# EAGLE design supply1 (EAGLE 7.5.0)
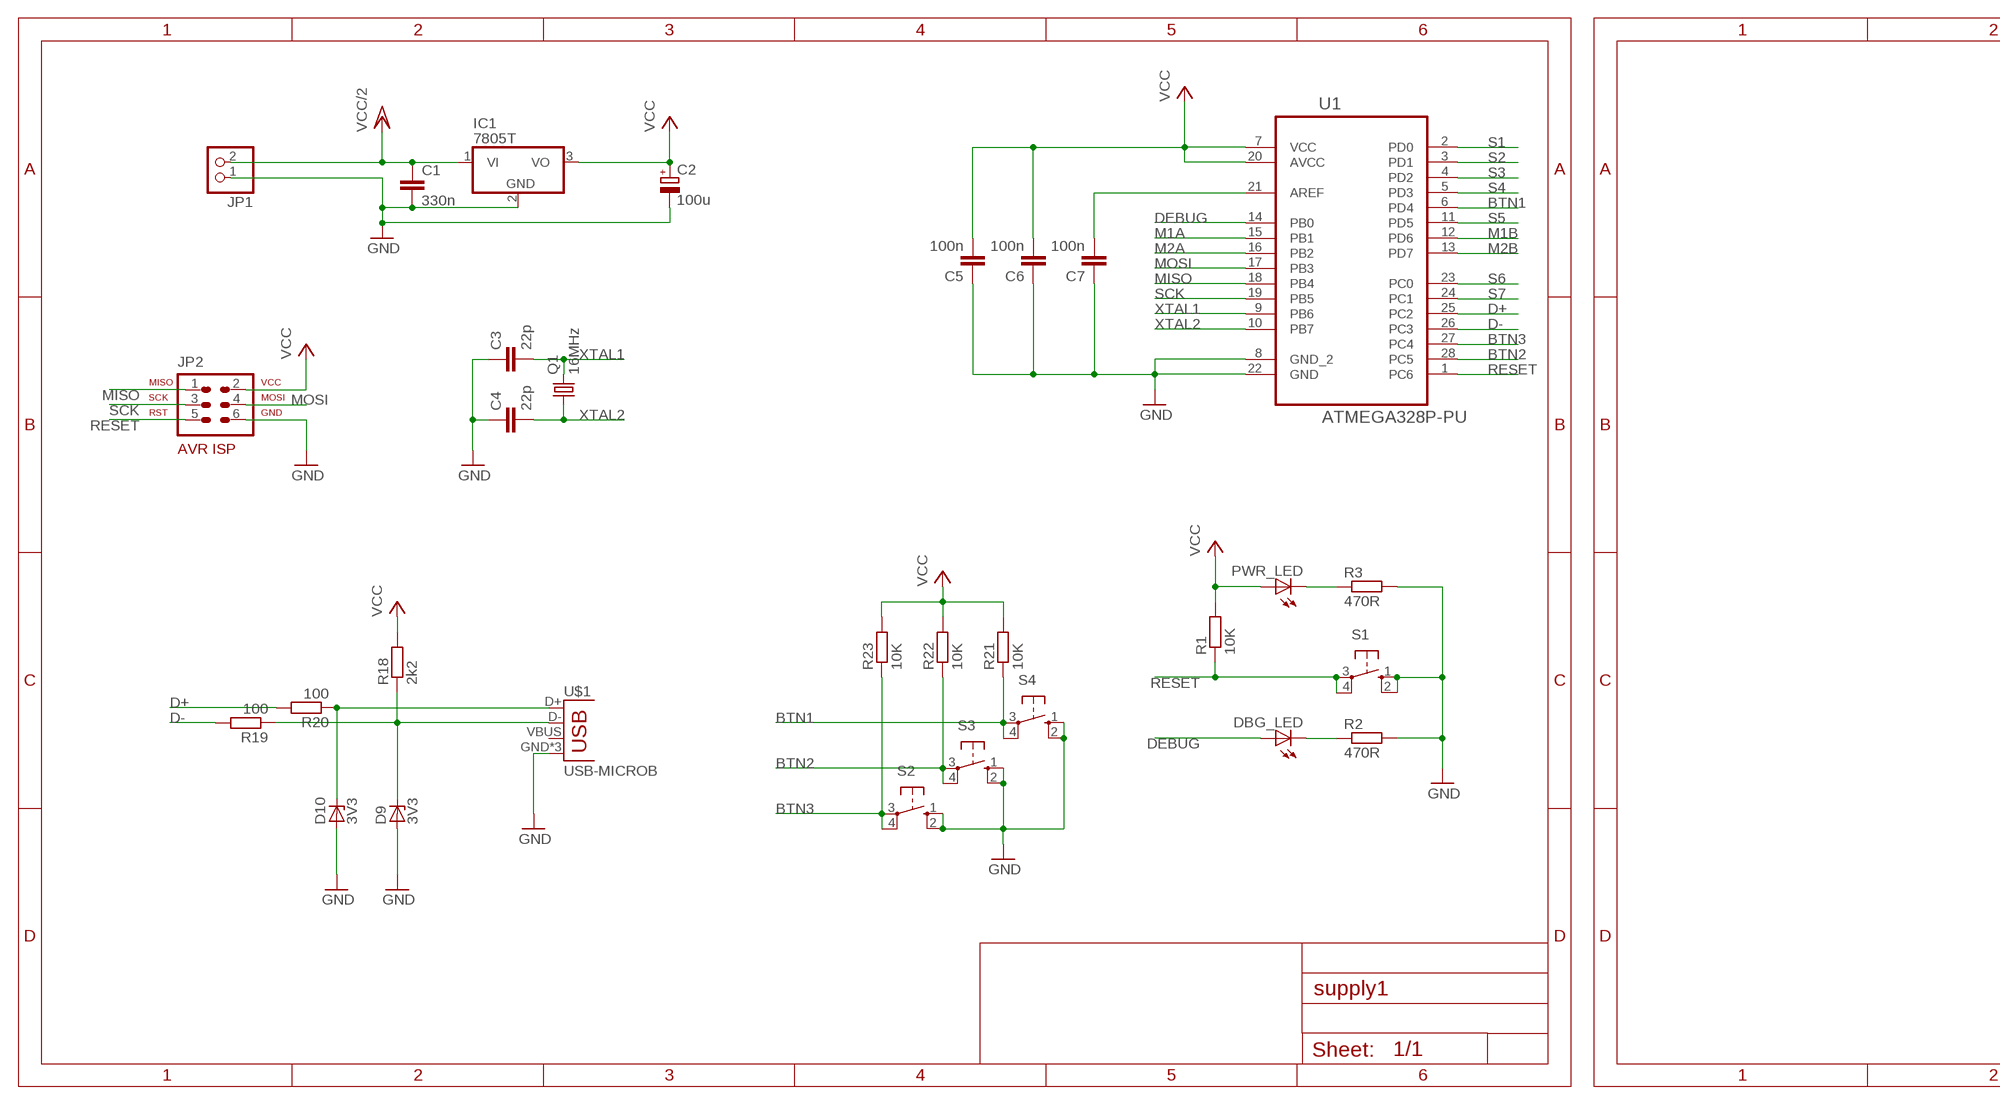
[diagram p0: schematic, sheet 1, part 1 of 2]
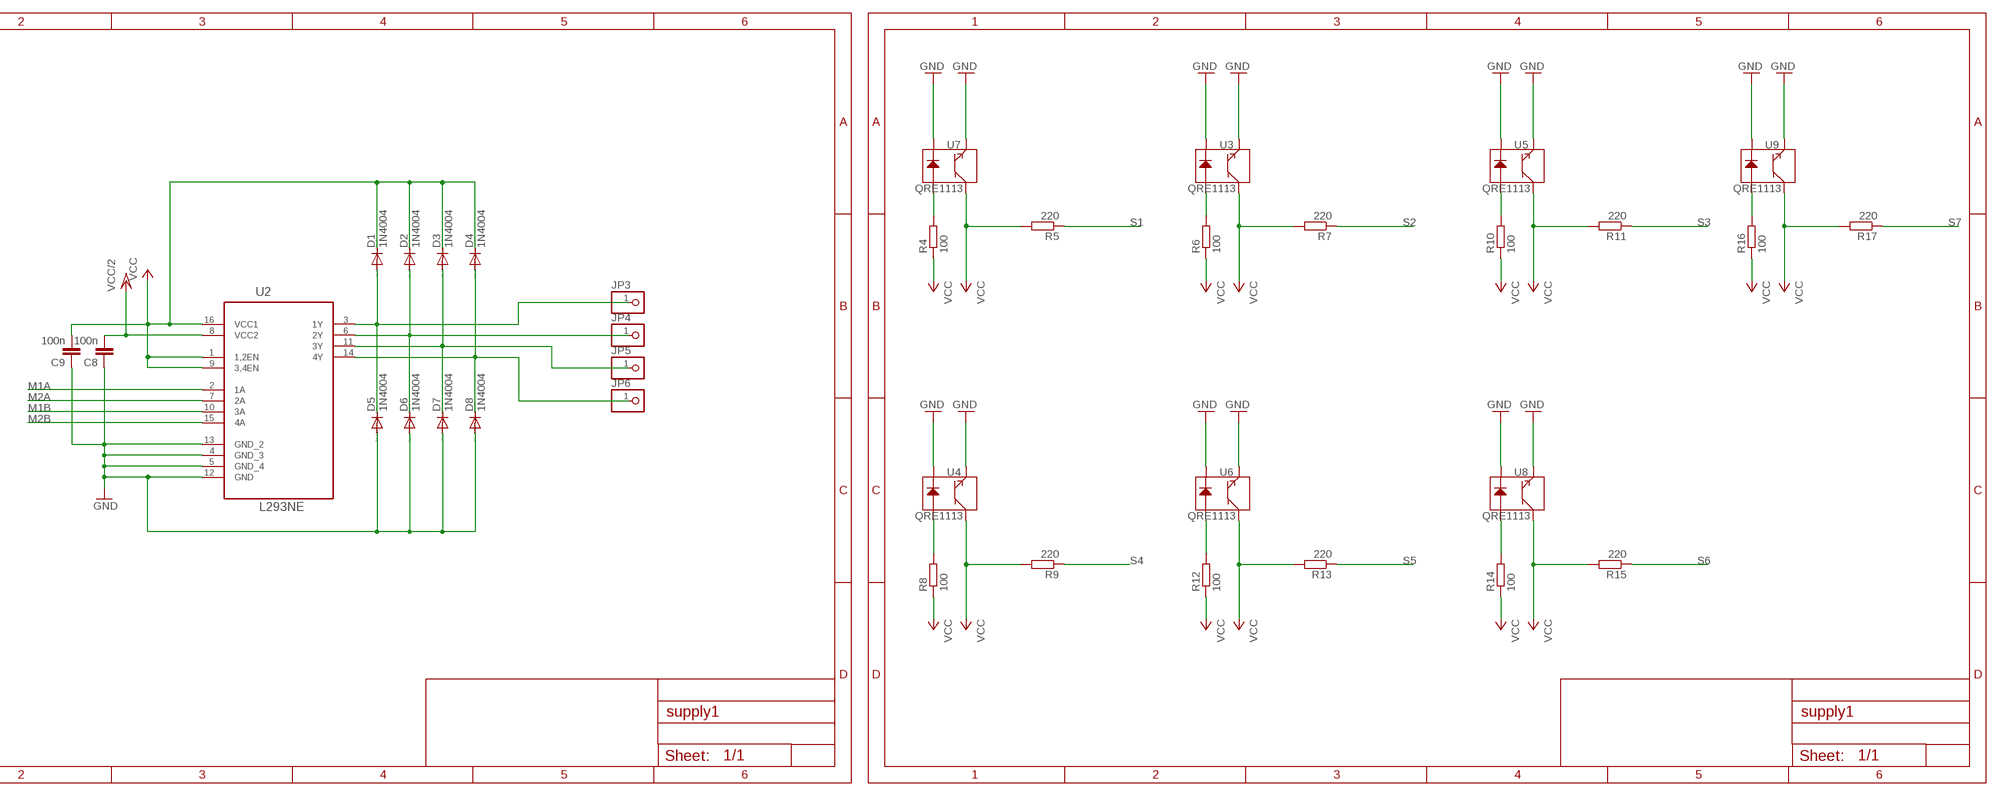
[diagram p1: schematic, sheet 1, part 2 of 2]

## Parts
C1  330n  C-EUC1206K  [C1206K]
C2  100u  CPOL-EUE2.5-5  [E2,5-5]
C3  22p  C-EUC0805K  [C0805K]
C4  22p  C-EUC0805K  [C0805K]
C5  100n  C-EUC0805K  [C0805K]
C6  100n  C-EUC0805K  [C0805K]
C7  100n  C-EUC0805K  [C0805K]
C8  100n  C-EUC0805K  [C0805K]
C9  100n  C-EUC0805K  [C0805K]
D1  1N4004  [DO41-10]
D2  1N4004  [DO41-10]
D3  1N4004  [DO41-10]
D4  1N4004  [DO41-10]
D5  1N4004  [DO41-10]
D6  1N4004  [DO41-10]
D7  1N4004  [DO41-10]
D8  1N4004  [DO41-10]
D9  3V3  ZENER-DIODEDO41Z10  [DO41Z10]
D10  3V3  ZENER-DIODEDO41Z10  [DO41Z10]
DBG_LED  LED5MM  [LED5MM]
IC1  7805T  [TO220H]
JP1  PINHD-1X2  [1X02]
JP2  AVR-ISP-6VERT  [AVR-ISP-6]
JP3  PINHD-1X1  [1X01]
JP4  PINHD-1X1  [1X01]
JP5  PINHD-1X1  [1X01]
JP6  PINHD-1X1  [1X01]
PWR_LED  LED5MM  [LED5MM]
Q1  16MHz  CRYSTALHC49S  [HC49/S]
R1  10K  R-EU_M0805  [M0805]
R2  470R  R-EU_M0805  [M0805]
R3  470R  R-EU_M0805  [M0805]
R4  100  R-EU_M0805  [M0805]
R5  220  R-EU_M0805  [M0805]
R6  100  R-EU_M0805  [M0805]
R7  220  R-EU_M0805  [M0805]
R8  100  R-EU_M0805  [M0805]
R9  220  R-EU_M0805  [M0805]
R10  100  R-EU_M0805  [M0805]
R11  220  R-EU_M0805  [M0805]
R12  100  R-EU_M0805  [M0805]
R13  220  R-EU_M0805  [M0805]
R14  100  R-EU_M0805  [M0805]
R15  220  R-EU_M0805  [M0805]
R16  100  R-EU_M0805  [M0805]
R17  220  R-EU_M0805  [M0805]
R18  2k2  R-EU_M0805  [M0805]
R19  100  R-EU_M0805  [M0805]
R20  100  R-EU_M0805  [M0805]
R21  10K  R-EU_M0805  [M0805]
R22  10K  R-EU_M0805  [M0805]
R23  10K  R-EU_M0805  [M0805]
S1  10-XX  [B3F-10XX]
S2  10-XX  [B3F-10XX]
S3  10-XX  [B3F-10XX]
S4  10-XX  [B3F-10XX]
U1  ATMEGA328P-PU  [DIP254P762X457-28]
U2  L293NE  [DIP254P762X508-16]
U3  QRE1113  [QRE1113]
U4  QRE1113  [QRE1113]
U5  QRE1113  [QRE1113]
U6  QRE1113  [QRE1113]
U7  QRE1113  [QRE1113]
U8  QRE1113  [QRE1113]
U9  QRE1113  [QRE1113]
U$1  USB-MICROB  [USB-MICROB]

## Nets
BTN1: R21.1 S4.3(P) S4.4(P1) U1.6(PD4)
BTN2: R22.1 S3.3(P) S3.4(P1) U1.28(PC5)
BTN3: R23.1 S2.3(P) S2.4(P1) U1.27(PC4)
D+: R20.2 U1.25(PC2)
D-: R19.2 U1.26(PC3)
DEBUG: DBG_LED.A U1.14(PB0)
GND: C1.2 C2.- C3.1 C4.1 C5.1 C6.1 C7.1 C8.1 C9.1 D5.A D6.A D7.A D8.A D9.A D10.A IC1.2(GND) JP1.1 JP2.6 R2.2 R3.2 S1.1(S) S1.2(S1) S2.1(S) S2.2(S1) S3.1(S) S3.2(S1) S4.1(S) S4.2(S1) U1.8(GND_2) U1.22(GND) U2.4(GND_3) U2.5(GND_4) U2.12(GND) U2.13(GND_2) U3.2(K) U3.4(E) U4.2(K) U4.4(E) U5.2(K) U5.4(E) U6.2(K) U6.4(E) U7.2(K) U7.4(E) U8.2(K) U8.4(E) U9.2(K) U9.4(E) U$1.GND U$1.MT1(GND) U$1.MT2(GND)
M1A: U1.15(PB1) U2.2(1A)
M1B: U1.12(PD6) U2.10(3A)
M2A: U1.16(PB2) U2.7(2A)
M2B: U1.13(PD7) U2.15(4A)
MISO: JP2.1 U1.18(PB4)
MOSI: JP2.4 U1.17(PB3)
N$1: PWR_LED.K(C) R3.1
N$2: DBG_LED.K(C) R2.1
N$3: C7.2 U1.21(AREF)
N$4: D1.A D5.C JP3.1 U2.3(1Y)
N$5: D2.A D6.C JP4.1 U2.6(2Y)
N$6: D3.A D7.C JP5.1 U2.11(3Y)
N$7: D4.A D8.C JP6.1 U2.14(4Y)
N$8: R4.2 U7.1(A)
N$9: R6.2 U3.1(A)
N$10: R8.2 U4.1(A)
N$11: R10.2 U5.1(A)
N$12: R12.2 U6.1(A)
N$13: R14.2 U8.1(A)
N$14: R16.2 U9.1(A)
N$16: D9.C R18.1 R19.1 U$1.D-
N$19: D10.C R20.1 U$1.D+
RESET: JP2.5 R1.1 S1.3(P) S1.4(P1) U1.1(PC6)
S1: R5.1 U1.2(PD0)
S2: R7.1 U1.3(PD1)
S3: R11.1 U1.4(PD2)
S4: R9.1 U1.5(PD3)
S5: R13.1 U1.11(PD5)
S6: R15.1 U1.23(PC0)
S7: R17.1 U1.24(PC1)
SCK: JP2.3 U1.19(PB5)
VCC: C2.+ C5.2 C6.2 C9.2 D1.C D2.C D3.C D4.C IC1.3(VO) JP2.2 PWR_LED.A R1.2 R4.1 R5.2 R6.1 R7.2 R8.1 R9.2 R10.1 R11.2 R12.1 R13.2 R14.1 R15.2 R16.1 R17.2 R18.2 R21.2 R22.2 R23.2 U1.7(VCC) U1.20(AVCC) U2.1(1,2EN) U2.9(3,4EN) U2.16(VCC1) U3.3(C) U4.3(C) U5.3(C) U6.3(C) U7.3(C) U8.3(C) U9.3(C)
VCC/2: C1.1 C8.2 IC1.1(VI) JP1.2 U2.8(VCC2)
XTAL1: C3.2 Q1.2 U1.9(PB6)
XTAL2: C4.2 Q1.1 U1.10(PB7)
Unconnected: U$1.VBUS

## Library data of the parts
C1 C3-C9 = resistor:C-EU: CAPACITOR, European symbol
C2 = resistor:CPOL-EU: POLARIZED CAPACITOR, European symbol
D1-D8 = diode:1N4004: DIODE general purpose rectifier, 1 A
D9 D10 = diode:ZENER-DIODE: Z-Diode
DBG_LED PWR_LED = led:LED: LED OSRAM: - CHIPLED LG R971, LG N971, LY N971, LG Q971, LY Q971, LO R971, LY R971 LH N974, LH R974 LS Q976, LO Q976, LY Q976 LO Q996 - Hyper CHIPLED LW Q18S LB Q993, LB Q99A, LB R99A - SideLED LS A670, LO A670, LY A670, LG A670, LP A670 LB A673, LV A673, LT A673, LW A673 LH A674 LY A675 LS A676, LA A676, LO A676, LY A676, LW A676 LS A679, LY A679, LG A679 - Hyper Micro SIDELED® LS Y876, LA Y876, LO Y876, LY Y876 LT Y87S - SmartLED LW L88C, LW L88S LB L89C, LB L89S, LG L890 LS L89K, LO L89K, LY L89K LS L896, LA L896, LO L896, LY L896 - TOPLED LS T670, LO T670, LY T670, LG T670, LP T670 LSG T670, LSP T670, LSY T670, LOP T670, LYG T670 LG T671, LOG T671, LSG T671 LB T673, LV T673, LT T673, LW T673 LH T674 LS T676, LA T676, LO T676, LY T676, LB T676, LH T676, LSB T676, LW T676 LB T67C, LV T67C, LT T67C, LS T67K, LO T67K, LY T67K, LW E67C LS E67B, LA E67B, LO E67B, LY E67B, LB E67C, LV E67C, LT E67C LW T67C LS T679, LY T679, LG T679 LS T770, LO T770, LY T770, LG T770, LP T770 LB T773, LV T773, LT T773, LW T773 LH T774 LS E675, LA E675, LY E675, LS T675 LS T776, LA T776, LO T776, LY T776, LB T776 LHGB T686 LT T68C, LB T68C - Hyper Mini TOPLED® LB M676 - Mini TOPLED Santana® LG M470 LS M47K, LO M47K, LY M47K Source: http://www.osram.convergy.de LUXEON: - LUMILED® LXK2-PW12-R00, LXK2-PW12-S00, LXK2-PW14-U00, LXK2-PW14-V00 LXK2-PM12-R00, LXK2-PM12-S00, LXK2-PM14-U00 LXK2-PE12-Q00, LXK2-PE12-R00, LXK2-PE12-S00, LXK2-PE14-T00, LXK2-PE14-U00 LXK2-PB12-K00, LXK2-PB12-L00, LXK2-PB12-M00, LXK2-PB14-N00, LXK2-PB14-P00, LXK2-PB14-Q00 LXK2-PR12-L00, LXK2-PR12-M00, LXK2-PR14-Q00, LXK2-PR14-R00 LXK2-PD12-Q00, LXK2-PD12-R00, LXK2-PD12-S00 LXK2-PH12-R00, LXK2-PH12-S00 LXK2-PL12-P00, LXK2-PL12-Q00, LXK2-PL12-R00 Source: www.luxeon.com KINGBRIGHT: KA-3528ASYC Source: www.kingbright.com
IC1 = linear:78*: Positive VOLTAGE REGULATOR Source: http://cache.national.com/ds/LM/LM78L05.pdf http://www.fairchildsemi.com/ds/LM/LM7805.pdf
JP1 = pinhead:PINHD-1X2: PIN HEADER
JP2 = avr-7:AVR-ISP-6: AVR ISP-6 Serial Programming Header
JP3-JP6 = pinhead:PINHD-1X1: PIN HEADER
Q1 = crystal:CRYSTAL: CRYSTAL; OC_FARNELL: 1667008; OC_NEWARK: unknown
R1-R23 = resistor:R-EU_: RESISTOR, European symbol
S1-S4 = switch-omron:10-XX: OMRON SWITCH; MPN: B3F-1000; OC_FARNELL: 176432; OC_NEWARK: 36M3542
U1 = untitled:ATMEGA328P-PU: 8-bit Microcontroller with In-System Programmable Flash; MPN: ATMEGA328P-PU; OC_FARNELL: 1715487; OC_NEWARK: 15R0268; PACKAGE: PDIP-28; SUPPLIER: Atmel
U2 = untitled:L293NE: QUADRUPLE HALF-H DRIVERS; MPN: L293NE; OC_FARNELL: -; OC_NEWARK: 06F9524; PACKAGE: PDIP-16; SUPPLIER: Texas Instruments
U3-U9 = SparkFun-Sensors:QRE1113: Reflective object sensor; PROD_ID: IC-09357
U$1 = SparkFun-Connectors:USB: USB Connectors USB-B-PTH is fully proven SKU : PRT-00139/CONN-08278 USB-miniB is fully proven SKU : PRT-00587 USB-A-PCB is untested. USB-A-H is throughly reviewed, but untested. Spark Fun Electronics SKU : PRT-00437 USB-B-SMT is throughly reviewed, but untested. Needs silkscreen touching up. USB-A-S has not been used/tested USB-MB-H has not been used/tested USB-MICROB has been used. CONN-09505; PROD_ID: CONN-09505

## Board
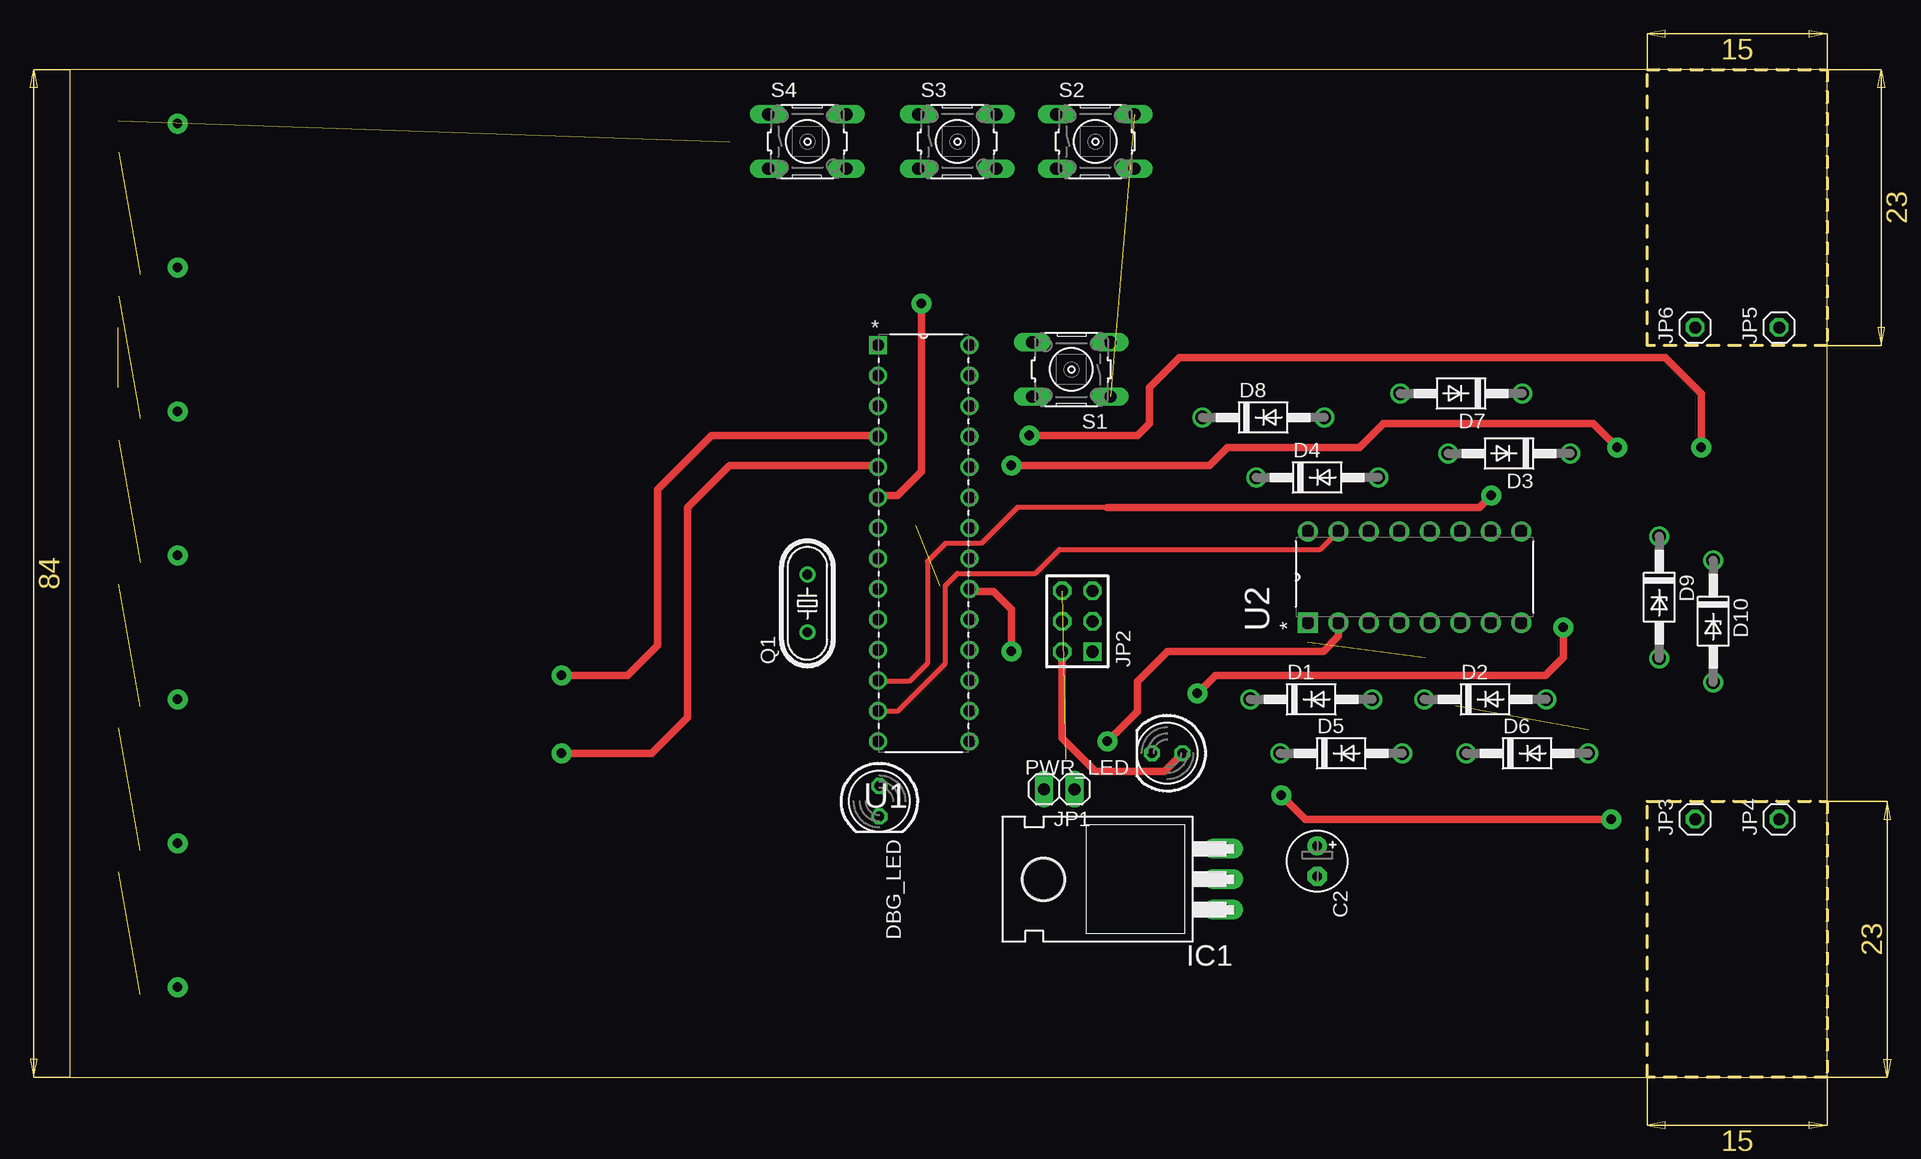
[diagram p2: board, top side]
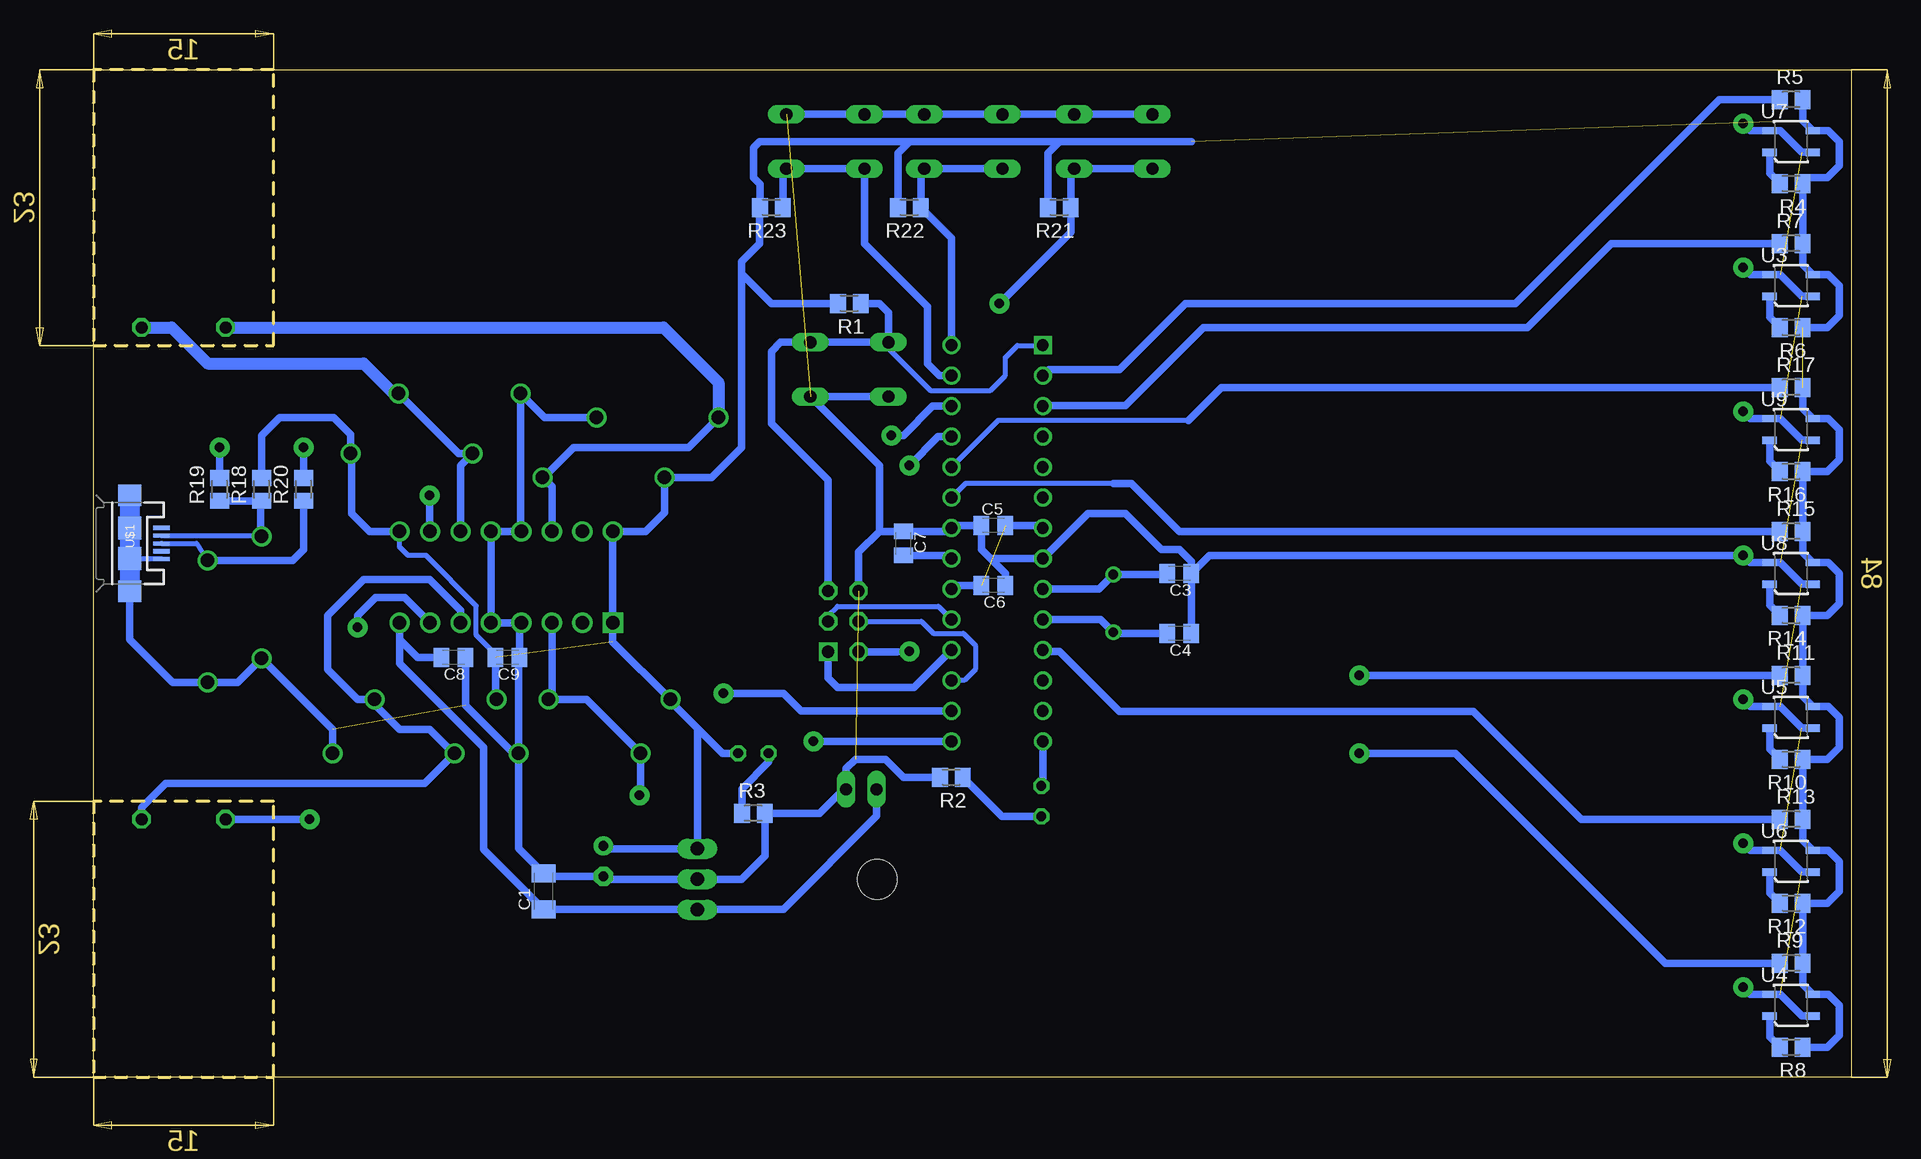
[diagram p3: board, bottom side, seen from below]

Size 146.5 x 84 mm. Coordinates in mm from the lower left corner, seen from the top.
Outline: 131.5,0 0,0 0,84 131.5,84
Outline: 131.5,0 146.5,0
Outline: 146.5,0 146.5,23
Outline: 146.5,23 146.5,61
Outline: 146.5,61 146.5,84
Outline: 146.5,84 131.5,84
Outline: 131.5,84 146.5,84
Outline: 146.5,84 146.5,61
Outline: 146.5,61 131.5,61 131.5,84
Outline: 131.5,0 131.5,23 146.5,23
Outline: 146.5,23 146.5,0
Outline: 146.5,0 131.5,0
Copper layers (1*16): Top 0.035mm / dielectric 1.5mm / Bottom 0.035mm
Design rules "default": minimum track width 10mil, minimum drill 24mil, track to track 8mil, track to pad 8mil, pad to pad 8mil, via to via 8mil, smd to smd 8mil, copper to edge 40mil, drill to drill 8mil, minimum pad ring 10mil, minimum via ring 8mil, stop-mask expansion 4mil, vias tented up to drill 0mil, thermal gap 10mil

### Footprints (pad centres in the part's own frame; a part is rotated, then mirrored left to right if it is on the bottom)
C1206K = smd 1.5 x 2: 1 -1.5,0; 2 1.5,0
E2,5-5 = drill 0.813 pad 1.6: + -1.27,0 | drill 0.813 pad 1.6 octagon: - 1.27,0
C0805K = smd 1.3 x 1.6: 1 -1,0; 2 1,0
DO41-10 = drill 1.118: A 5.08,0; C -5.08,0
DO41Z10 = drill 1.118: A 5.08,0; C -5.08,0
LED5MM = drill 0.813 octagon: A -1.27,0; K 1.27,0
TO220H = drill 1.118 long: 1 -2.54,-10.16; 2 0,-10.16; 3 2.54,-10.16 | hole 3.302: 0,4.826
1X02 = drill 1.016 long: 1 -1.27,0; 2 1.27,0
AVR-ISP-6 = drill 1.016 square: 1 -2.54,-1.27 | drill 1.016 octagon: 2 -2.54,1.27; 3 0,-1.27; 4 0,1.27; 5 2.54,-1.27; 6 2.54,1.27
1X01 = drill 1.016 octagon: 1 0,0
HC49/S = drill 0.813: 1 -2.413,0; 2 2.413,0
M0805 = smd 1.3 x 1.6: 1 -0.95,0; 2 0.95,0
B3F-10XX = drill 1.016 long: 1 -3.251,2.261; 2 3.251,2.261; 3 -3.251,-2.261; 4 3.251,-2.261
DIP254P762X457-28 = drill 0.991 square: 1 -7.62,33.02 | drill 0.991: 2 -7.62,30.48; 3 -7.62,27.94; 4 -7.62,25.4; 5 -7.62,22.86; 6 -7.62,20.32; 7 -7.62,17.78; 8 -7.62,15.24; 9 -7.62,12.7; 10 -7.62,10.16; 11 -7.62,7.62; 12 -7.62,5.08; 13 -7.62,2.54; 14 -7.62,0; 15 0,0; 16 0,2.54; 17 0,5.08; 18 0,7.62; 19 0,10.16; 20 0,12.7; 21 0,15.24; 22 0,17.78; 23 0,20.32; 24 0,22.86; 25 0,25.4; 26 0,27.94; 27 0,30.48; 28 0,33.02
DIP254P762X508-16 = drill 1.118 square: 1 -7.62,17.78 | drill 1.118: 2 -7.62,15.24; 3 -7.62,12.7; 4 -7.62,10.16; 5 -7.62,7.62; 6 -7.62,5.08; 7 -7.62,2.54; 8 -7.62,0; 9 0,0; 10 0,2.54; 11 0,5.08; 12 0,7.62; 13 0,10.16; 14 0,12.7; 15 0,15.24; 16 0,17.78
QRE1113 = smd 1.2 x 0.6: 1 -1.8,-0.9; 2 1.8,-0.9; 3 1.8,0.9; 4 -1.8,0.9
USB-MICROB = smd 0.35 x 1.4: D+ 0,2.65; D- -0.65,2.65; GND 1.3,2.65; ID 0.65,2.65; VBUS -1.3,2.65 | smd 1.8 x 1.9: MT1 -4,0; MT2 4,0 | smd 1.9 x 1.9: P$1 -1.27,0; P$2 1.27,0

### Placement (x,y rotation side)
C1  109,15.5 90 bottom
C2  104,18 270 top
C3  56,42 180 bottom
C4  56,37 180 bottom
C5  71.5,46 0 bottom
C6  71.5,41 180 bottom
C7  79,44.5 270 bottom
C8  116.5,35 180 bottom
C9  112,35 180 bottom
D1  103.5,31.5 0 top
D2  118,31.5 0 top
D3  120,52 180 top
D4  104,50 0 top
D5  106,27 0 top
D6  121.5,27 0 top
D7  116,57 180 top
D8  99.5,55 0 top
D9  132.5,40 270 top
D10  137,38 270 top
DBG_LED  67.5,23 270 top
IC1  86,16.5 90 top
JP1  82.5,24 180 top
JP2  84,38 90 top
JP3  135.5,21.5 90 top
JP4  142.5,21.5 90 top
JP5  142.5,62.5 90 top
JP6  135.5,62.5 90 top
PWR_LED  91.5,27 180 top
Q1  61.5,39.5 90 top
R1  83.5,64.5 180 bottom
R2  75,25 180 bottom
R3  91.5,22 0 bottom
R4  5,74.5 180 bottom
R5  5,81.5 0 bottom
R6  5,62.5 180 bottom
R7  5,69.5 0 bottom
R8  5,2.5 180 bottom
R9  5,9.5 0 bottom
R10  5,26.5 180 bottom
R11  5,33.5 0 bottom
R12  5,14.5 180 bottom
R13  5,21.5 0 bottom
R14  5,38.5 180 bottom
R15  5,45.5 0 bottom
R16  5,50.5 180 bottom
R17  5,57.5 0 bottom
R18  132.5,49 90 bottom
R19  136,49 90 bottom
R20  129,49 90 bottom
R21  66,72.5 180 bottom
R22  78.5,72.5 180 bottom
R23  90,72.5 180 bottom
S1  83.5,59 180 top
S2  85.5,78 0 top
S3  74,78 0 top
S4  61.5,78 0 top
U1  75,28 0 top
U2  121,45.5 90 top
U3  5,66 0 bottom
U4  5,6 0 bottom
U5  5,30 0 bottom
U6  5,18 0 bottom
U7  5,78 0 bottom
U8  5,42 0 bottom
U9  5,54 0 bottom
U$1  143.5,44.5 270 bottom

### Tracks (layer width: path | path; a pad name or v marks a point on that pad's centre or on a via)
BTN1  (via drill 0.8 pad 1.68)
  Top 0.61: v71,64.5 71,50.5 69,48.5 67.56,48.5 U1.6
  Bottom 0.61: S4.3 S4.4 65.05,75.44 R21.1 65.05,70.45 v71,64.5
BTN2
  Bottom 0.61: S3.3 S3.4 77.55,75.44 R22.1 75,69.95 U1.28
BTN3
  Bottom 0.61: S2.3 82.05,75.74 | S2.3 S2.4 89.05,75.44 R23.1 | U1.27 75.98,58.48 77,59.5 77,64.25 82.25,69.5 S2.3
D+  (via drill 0.8 pad 1.68)
  Top 0.61: v129,52.5 127,54.5 109.5,54.5 107.5,52.5 96.5,52.5 95,51 v78.5,51
  Bottom 0.61: R20.2 v129,52.5 | v78.5,51 76.1,53.4 U1.25
D-  (via drill 0.8 pad 1.68)
  Top 0.61: v136,52.5 136,57 133,60 92.5,60 90,57.5 90,54.5 89,53.5 v80,53.5
  Bottom 0.61: R19.2 v136,52.5 | v80,53.5 79,53.5 76.56,55.94 U1.26
DEBUG
  Bottom 0.61: U1.14 67.38,24.39 DBG_LED.A
GND  (via drill 0.8 pad 1.68)  (9 unrouted)
  Bottom 0.41: U$1.GND 143.3,43.2 143.5,43
  Bottom 0.61: U4.2 4.1,5.1 5.9,6.9 U4.4 8.4,6.9 v9,7.5 | S1.2 S1.1 81,50.99 81,45.5 | U3.2 4.1,65.1 5.9,66.9 U3.4 8.4,66.9 v9,67.5 | U7.2 4.1,77.1 5.9,78.9 U7.4 8.4,78.9 v9,79.5 | S4.1 S4.2 S3.1 S3.2 S2.1 S2.2 | C3.1 C4.1 | U$1.MT2 143.5,36.5 139.92,32.92 D10.A 134.5,32.92 D9.A 126.58,29 D6.A | v9,55.5 8.4,54.9 U9.4 5.9,54.9 4.1,53.1 U9.2 | D5.A 111.08,34.92 C9.1 111,37.72 U2.4 U2.5 U2.12 U2.13 110.92,45.58 D7.A 108.92,55 D8.A | U8.2 4.1,41.1 5.9,42.9 U8.4 8.4,42.9 v9,43.5 53.5,43.5 C3.1 | U5.2 4.1,29.1 5.9,30.9 U5.4 8.4,30.9 v9,31.5 | U6.2 4.1,17.1 5.9,18.9 U6.4 8.4,18.9 v9,19.5 | D5.A 111.08,19.08 C1.2 108.73,16.73 C2.- 103.77,16.5 IC1.2 92.5,16.5 90.55,18.45 R3.2 86,22 84,24 JP1.1 83.77,25.73 83,26.5 80.5,26.5 79,25 R2.2 | JP2.6 82.73,43.77 81,45.5 | 81,45.5 C7.1 75.28,45.5 U1.22 74.78,46 C5.1 72.5,44 71.74,43.24 | 71.74,43.24 U1.8 63.62,47 60.5,47 57.5,44 56,44 55,43 C3.1 | C6.1 70.5,42 71.74,43.24 | C8.1 115.5,31 111.5,27 D5.A
  Bottom 1.674: U$1.MT1 143.5,43 U$1.MT2
  cutout Top (isolate 0.61): 0,0 0,84 146.5,84 146.5,0
  cutout Bottom (isolate 0.61): 0,0 0,84 146.5,84 146.5,0
M1A  (via drill 0.8 pad 1.68)
  Top 0.61: U2.2 105.76,36.76 104.5,35.5 91.5,35.5 89,33 89,30.5 v86.5,28
  Bottom 0.61: U1.15 v86.5,28
M1B  (via drill 0.8 pad 1.68)
  Top 0.406: 86.5,47.5 79,47.5 76,44.5 73,44.5 71.5,43 71.5,34.5 70,33 67.46,33 U1.12
  Top 0.61: 86.5,47.5 117.5,47.5 v118.5,48.5
  Bottom 0.61: U2.10 118.5,45.54 v118.5,48.5
M2A  (via drill 0.8 pad 1.68)
  Top 0.61: v94,32 95.5,33.5 123,33.5 124.5,35 v124.5,37.5
  Bottom 0.61: U2.7 120.58,40 123,40 124.5,38.5 v124.5,37.5 | U1.16 87.54,30.54 89,32 v94,32
M2B
  Top 0.406: U1.13 69.04,30.54 73,34.5 73,41 74,42 80.5,42 82.5,44 104.26,44 U2.15
MISO
  Bottom 0.61: JP2.1 85.27,33.27 84.5,32.5 78.12,32.5 U1.18
MOSI
  Bottom 0.406: JP2.4 77.5,38 76.5,37 74,37 73,36 73,34 73.92,33.08 U1.17
N$1
  Bottom 0.61: R3.1 92.45,24.05 90.23,26.27 PWR_LED.K
N$2
  Bottom 0.61: DBG_LED.K 70.78,21.73 R2.1
N$3
  Bottom 0.61: U1.21 75.26,43.5 C7.2
N$4  (via drill 0.8 pad 1.68)
  Top 0.61: v128.5,21.5 103,21.5 v101,23.5
  Bottom 0.61: U2.3 108.3,31.78 D1.A 105.42,31.5 D5.C 100.92,23.58 v101,23.5 | JP3.1 v128.5,21.5
N$5
  Bottom 0.61: U2.6 115.92,38.92 118.5,41.5 124,41.5 127,38.5 127,34 124.5,31.5 D2.A 123.08,31.08 121,29 118.5,29 116.5,27 D6.C 118.92,24.5 140.5,24.5 142.5,22.5 JP4.1
N$6
  Bottom 0.61: U2.11 115.92,51 D3.A 116.08,52 D7.C
  Bottom 1.016: JP5.1 140,62.5 137,59.5 124,59.5 121.5,57 D7.C
N$7
  Bottom 0.61: U2.14 108.3,49.22 D4.A 109,50 106.5,52.5 96.92,52.5 D8.C
  Bottom 1.016: JP6.1 99,62.5 94.42,57.92 D8.C
N$8
  Bottom 0.61: U7.1 6.8,75.35 R4.2
N$9
  Bottom 0.61: R6.2 6.8,63.35 U3.1
N$10
  Bottom 0.61: R8.2 6.8,3.35 U4.1
N$11
  Bottom 0.61: R10.2 6.8,27.35 U5.1
N$12
  Bottom 0.61: R12.2 6.8,15.35 U6.1
N$13
  Bottom 0.61: R14.2 6.8,39.35 U8.1
N$14
  Bottom 0.61: R16.2 6.8,51.35 U9.1
N$16
  Bottom 0.406: U$1.D- 132.57,45.15 D9.C
  Bottom 0.61: R19.1 R18.1 132.57,47.98 132.57,45.15
N$19
  Bottom 0.41: U$1.D+ 137.92,44.5 D10.C
  Bottom 0.61: D10.C 129.92,43.08 129,44 R20.1
RESET
  Bottom 0.406: S1.4 80.25,60.75 76.75,57.25 71.75,57.25 70.5,58.5 70.5,60 69.5,61 67.4,61 U1.1
  Bottom 0.61: JP2.5 85.27,49.77 90,54.5 90,60.5 89.24,61.26 S1.3 S1.4 80.25,63.75 81,64.5 R1.1
S1
  Bottom 0.61: U1.2 66.93,58.93 66.86,59 61,59 55.5,64.5 28,64.5 11,81.5 R5.1
S2
  Bottom 0.61: R7.1 20,69.5 27,62.5 54,62.5 60.5,56 67.32,56 U1.3
S3  (via drill 0.8 pad 1.68)
  Top 0.61: v41,33.5 46.5,33.5 49,36 49,49 53.5,53.5 67.28,53.5 U1.4
  Bottom 0.61: R11.1 v41,33.5
S4  (via drill 0.8 pad 1.68)
  Top 0.61: U1.5 67.24,51 55,51 51.5,47.5 51.5,30 48.5,27 v41,27
  Bottom 0.61: R9.1 15.5,9.5 33,27 v41,27
S5
  Bottom 0.61: R13.1 22.5,21.5 31.5,30.5 61,30.5 66,35.5 67.26,35.5 U1.11
S6
  Bottom 0.406: U1.23 73.91,49.41 73.82,49.5 61.5,49.5
  Bottom 0.61: R15.1 56,45.5 60,49.5 61.5,49.5
S7
  Bottom 0.406: 55.25,54.75 71.11,54.75 U1.24
  Bottom 0.61: R17.1 52.5,57.5 55.25,54.75
SCK
  Bottom 0.406: JP2.3 85.27,38.48 84.5,39.25 76.09,39.25 U1.19
VCC  (via drill 0.8 pad 1.68)  (4 unrouted)
  Top 0.61: PWR_LED.A 91.27,25.5 85.5,25.5 82.73,28.27 JP2.2 | U1.20 75.2,40.5 77,40.5 78.5,39 v78.5,35.5
  Bottom 0.406: C9.2 113.25,35 113.25,35.5 114.6,36.85 114.6,39.3 118.8,43.5 120.29,43.5 121,44.21 U2.9
  Bottom 0.61: R8.1 2,2.5 1,3.5 1,6 1.9,6.9 U4.3 4.05,7.75 R9.2 R12.1 2,14.5 1,15.5 1,18 1.9,18.9 U6.3 4.05,19.75 R13.2 R10.1 2,26.5 1,27.5 1,30 1.9,30.9 U5.3 4.05,31.75 R11.2 R14.1 2,38.5 1,39.5 1,42 1.9,42.9 U8.3 4.05,43.75 R15.2 R16.1 2,50.5 1,51.5 1,54 1.9,54.9 U9.3 4.05,55.75 R17.2 | R6.1 2,62.5 1,63.5 1,66 1.9,66.9 U3.3 4.05,67.75 R7.2 R4.1 3.55,75 2,75 1,76 1,78 1.9,78.9 U7.3 4.05,79.75 R5.2 | C2.+ 103.77,19.04 IC1.3 96.16,29.08 | D2.C 113,31.58 C9.2 | JP2.2 79.54,35.46 v78.5,35.5 | U1.20 74.7,41 C6.2 | U1.7 67.6,46 C5.2 | R18.2 132.5,53.5 131,55 126.5,55 125.08,53.58 D3.C 125,51.92 125,47 123.5,45.5 U2.9 | 96.16,29.08 98.5,31.42 D1.C 103.22,36.3 U2.1 U2.16 100.5,45.5 98.92,47.08 D4.C 95,50 92.5,52.5 92.5,67 | PWR_LED.A 94.08,27 96.16,29.08 | 78.5,78 91,78 91.5,77.5 91.5,75 90.95,74.45 R23.2 91,72.45 91,69.5 92.5,68 92.5,67 | 78.5,78 66,78 | 66,78 55,78 | R22.2 79.45,77.05 78.5,78 | R21.2 66.95,77.05 66,78 | R1.2 90,64.5 92.5,67
VCC/2
  Bottom 0.61: 121,36.5 121,34.5 114,27.5 114,19 C1.1 96.2,14 IC1.1 96.12,14 89,14 81.23,21.77 JP1.2 | 121,36.5 U2.8 | C8.2 119.5,35 121,36.5
XTAL1
  Bottom 0.61: U1.9 62.71,40.7 Q1.2 57.09,41.91 C3.2
XTAL2
  Bottom 0.61: U1.10 62.57,38.16 Q1.1 61.41,37 C4.2